# Altium schematic sheet input_hv.SchDoc
size A4; SheetNumber: 2; SheetTotal: 14
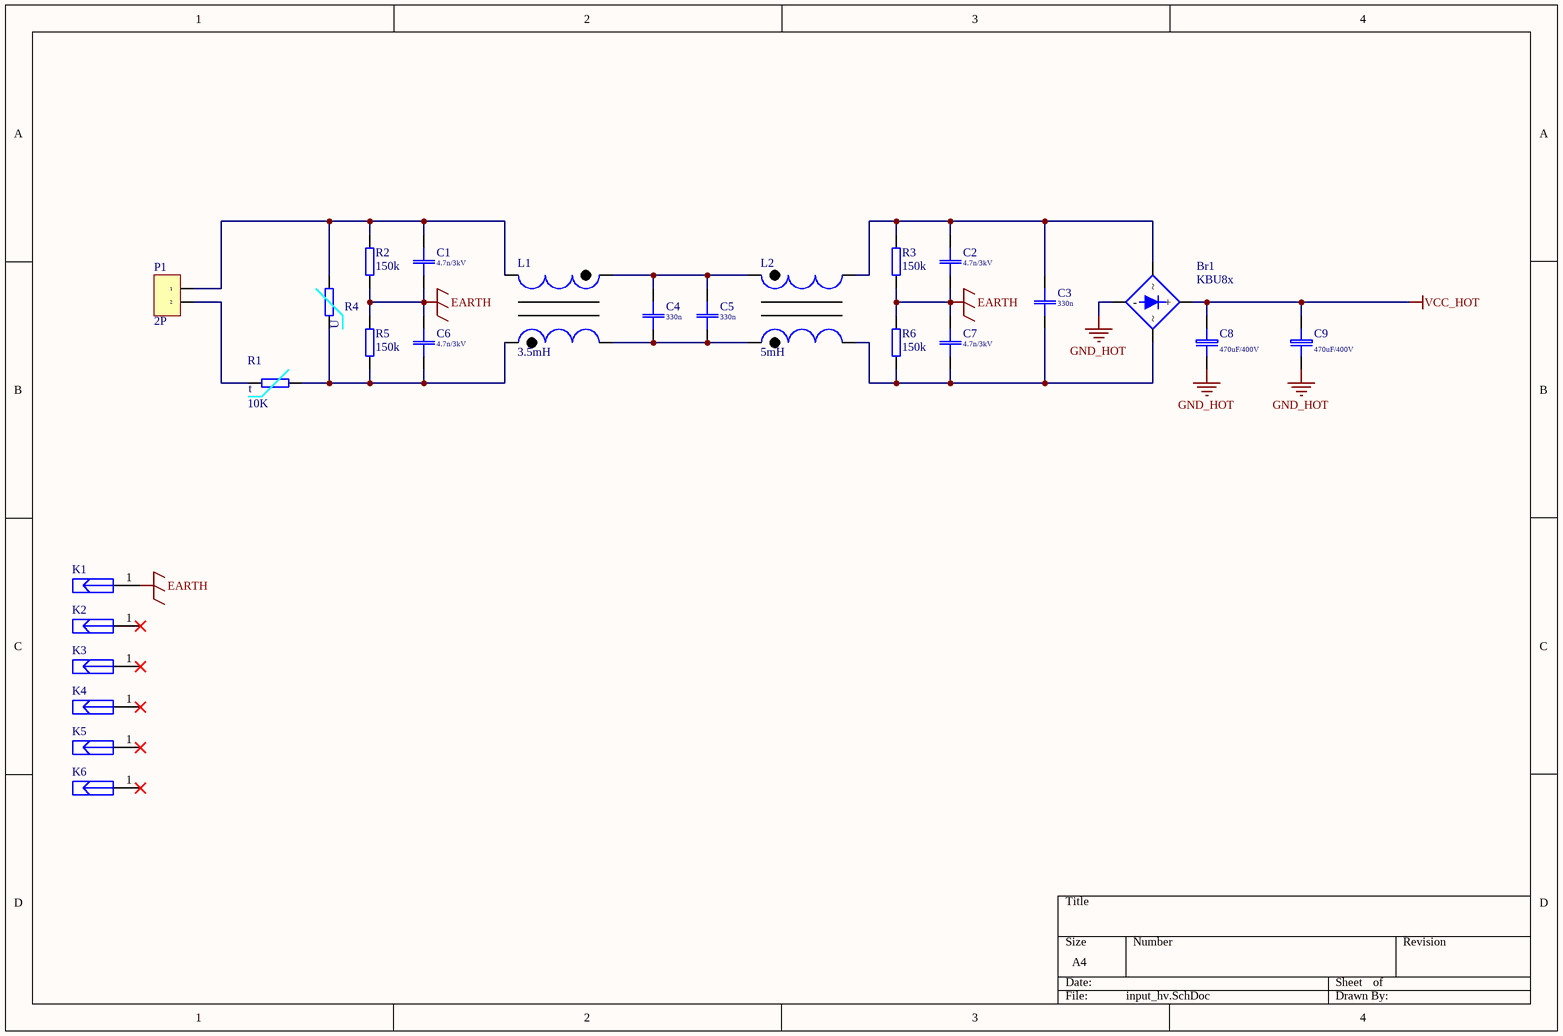
[diagram p0: input_hv.SchDoc]

## Parts
Br1  KBU8x  [KBU-200 h22mm]
C1  4.7n/3kV  [Cer-Disk-D8-R7.62]
C2  4.7n/3kV  [Cer-Disk-D8-R7.62]
C3  330n  [MKP X2 100nF 275V AC]
C4  330n  [MKP X2 100nF 275V AC]
C5  330n  [MKP X2 100nF 275V AC]
C6  4.7n/3kV  [Cer-Disk-D8-R7.62]
C7  4.7n/3kV  [Cer-Disk-D8-R7.62]
C8  470uF/400V  [CAP: D25C10H50]
C9  470uF/400V  [CAP: D25C10H50]
K1  (no value)  [CON: TH 3.5mm]
K2  (no value)  [CON: TH 3.5mm]
K3  (no value)  [CON: TH 3.5mm]
K4  (no value)  [CON: TH 3.5mm]
K5  (no value)  [CON: TH 3.5mm]
K6  (no value)  [CON: TH 3.5mm]
L1  3.5mH  [IND: R26.9/14.7/11.2 (H)]
L2  5mH  [IND: R26.9/14.7/11.2 (H)]
P1  2P  [CON: 2P V 3.5mm]
R1  10K  [RES: NTC D15-R7.62]
R2  150k  [RES: 0.125W H]
R3  150k  [RES: 0.125W H]
R4  VAR  [RES: VAR 11K 300]  (value not drawn)
R5  150k  [RES: 0.125W H]
R6  150k  [RES: 0.125W H]

## Nets
EARTH: C1.2 C2.2 C6.1 C7.1 K1.1 R2.2 R3.2 R5.1 R6.1
GND_HOT: Br1.2(-) C8.2(-) C9.2(-)
VCC_HOT: Br1.1(+) C8.1(+) C9.1(+)
NetBr1_3: Br1.3 C3.2 C7.2 L2.4 R6.2
NetBr1_4: Br1.4 C2.1 C3.1 L2.2 R3.1
NetC1_1: C1.1 L1.1 P1.1 R2.1 R4.2
NetC4_1: C4.1 C5.1 L1.2 L2.1
NetC4_2: C4.2 C5.2 L1.4 L2.3
NetC6_2: C6.2 L1.3 R1.2 R4.1 R5.2
NetP1_2: P1.2 R1.1

Not connected (* = marked no-connect by the designer): K2 1*; K3 1*; K4 1*; K5 1*; K6 1*

## Notes on the sheet
- (in symbol R_NTC) t
- (in symbol R_VAR) U

## Library data of the parts
Br1 = KBU: Грец  8A; Price: 0.52
C1 C2 C6 C7 = Cer Disc HV 2.2n 2kV: 2.2n 2kV Y5P; Tip: Suntan TS16 2.2nF 2kV Y5P; Price: 0.072; Value: 4.7n/3kV
C3-C5 = X2 100n 275V AC: X2 250V AC; Price: 0.15; Value: 330n
C8 C9 = C_EL: Value: 470uF/400V
K1-K6 = PCB CON
L1 = DROSSEL_1: Value: 3.5mH
L2 = DROSSEL: Value: 5mH
R1 = R_NTC: Value: 10K
R2 R3 R5 R6 = R_DIP: Value: 150k
R4 = R_VAR: Value: VAR
P1 = 2P: Value: 2P